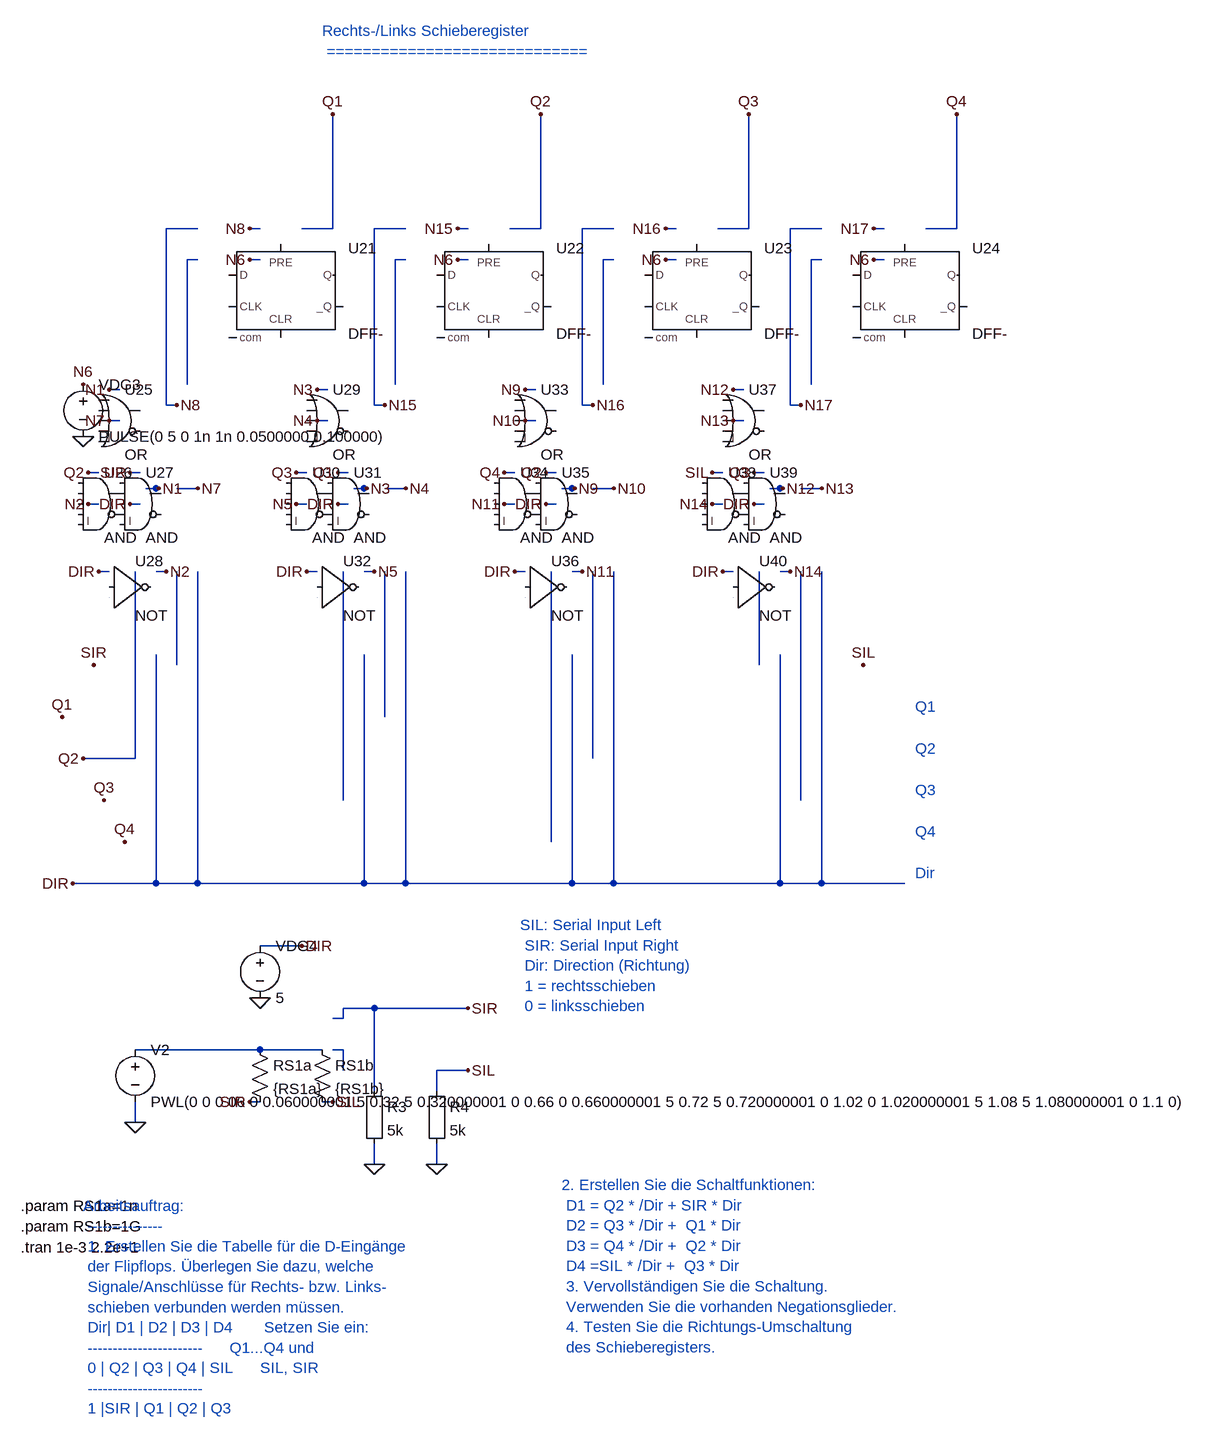
[diagram p0: schematic 6_3_2_Rechts_Links_Schieberegister_Lsg.asc]
6_3_2_Rechts_Links_Schieberegister_Lsg.asc, the LTspice schematic file:
Version 4
SHEET 1 880 680
WIRE 240 1664 240 1680
WIRE 432 1584 528 1584
WIRE 496 320 544 320
WIRE 544 320 544 144
WIRE 1136 320 1184 320
WIRE 1184 320 1184 144
WIRE 816 320 864 320
WIRE 864 320 864 144
WIRE 1504 144 1504 320
WIRE 1504 320 1456 320
WIRE 320 560 320 368
WIRE 320 368 336 368
WIRE 656 368 640 368
WIRE 640 368 640 560
WIRE 1296 368 1280 368
WIRE 1280 368 1280 560
WIRE 976 368 960 368
WIRE 960 368 960 560
WIRE 240 1696 240 1680
WIRE 256 720 272 720
WIRE 304 720 320 720
WIRE 288 592 288 320
WIRE 288 320 336 320
WIRE 576 720 592 720
WIRE 624 720 640 720
WIRE 896 720 912 720
WIRE 944 720 960 720
WIRE 1216 720 1232 720
WIRE 1264 720 1280 720
WIRE 608 592 608 320
WIRE 608 320 656 320
WIRE 928 592 928 320
WIRE 928 320 976 320
WIRE 1248 592 1248 320
WIRE 1248 320 1296 320
WIRE 144 1328 272 1328
WIRE 1232 1328 1296 1328
WIRE 1232 976 1232 1328
WIRE 976 1328 1232 1328
WIRE 976 848 976 1328
WIRE 912 1328 976 1328
WIRE 912 976 912 1328
WIRE 656 1328 912 1328
WIRE 656 848 656 1328
WIRE 592 1328 656 1328
WIRE 592 976 592 1328
WIRE 336 1328 592 1328
WIRE 336 848 336 1328
WIRE 272 1328 336 1328
WIRE 272 976 272 1328
WIRE 304 992 304 848
WIRE 160 1136 240 1136
WIRE 560 1200 560 848
WIRE 1200 992 1200 848
WIRE 1264 848 1264 1200
WIRE 880 1264 880 848
WIRE 624 1072 624 848
WIRE 1296 1328 1296 848
WIRE 1424 1328 1296 1328
WIRE 432 1424 496 1424
WIRE 432 1584 240 1584
WIRE 752 1520 608 1520
WIRE 752 1616 704 1616
WIRE 240 1136 240 848
WIRE 944 848 944 1136
WIRE 608 1760 608 1728
WIRE 608 1520 560 1520
WIRE 560 1520 560 1536
WIRE 560 1536 544 1536
WIRE 608 1648 608 1520
WIRE 704 1760 704 1728
WIRE 560 1616 560 1584
WIRE 560 1584 544 1584
WIRE 704 1648 704 1616
WIRE 1392 368 1376 368
WIRE 752 368 736 368
WIRE 432 368 416 368
WIRE 1072 368 1056 368
WIRE 256 720 276 720
WIRE 216 568 200 568
WIRE 216 616 200 616
WIRE 320 720 336 720
WIRE 288 592 304 592
WIRE 432 320 416 320
WIRE 568 696 552 696
WIRE 184 696 168 696
WIRE 888 696 872 696
WIRE 504 696 488 696
WIRE 1208 696 1192 696
WIRE 824 696 808 696
WIRE 1144 696 1128 696
WIRE 528 1664 544 1664
WIRE 248 696 232 696
WIRE 432 1664 416 1664
WIRE 1208 744 1192 744
WIRE 1160 848 1144 848
WIRE 888 744 872 744
WIRE 840 848 824 848
WIRE 568 744 552 744
WIRE 520 848 504 848
WIRE 248 744 232 744
WIRE 200 848 184 848
WIRE 184 744 168 744
WIRE 272 848 288 848
WIRE 576 720 596 720
WIRE 536 568 520 568
WIRE 536 616 520 616
WIRE 640 720 656 720
WIRE 504 744 488 744
WIRE 592 848 608 848
WIRE 896 720 916 720
WIRE 856 568 840 568
WIRE 856 616 840 616
WIRE 960 720 976 720
WIRE 824 744 808 744
WIRE 912 848 928 848
WIRE 1216 720 1236 720
WIRE 1176 568 1160 568
WIRE 1176 616 1160 616
WIRE 1280 720 1296 720
WIRE 1144 744 1128 744
WIRE 1232 848 1248 848
WIRE 608 592 624 592
WIRE 752 320 736 320
WIRE 928 592 944 592
WIRE 1072 320 1056 320
WIRE 1248 592 1264 592
WIRE 1392 320 1376 320
FLAG 160 640 0
FLAG 432 1504 0
FLAG 240 1696 0
FLAG 608 1760 0
FLAG 704 1760 0
FLAG 1376 368 N6
FLAG 736 368 N6
FLAG 416 368 N6
FLAG 160 560 N6
FLAG 1056 368 N6
FLAG 240 1696 0
FLAG 608 1760 0
FLAG 704 1760 0
FLAG 276 720 N1
FLAG 200 568 N1
FLAG 200 616 N7
FLAG 336 720 N7
FLAG 304 592 N8
FLAG 416 320 N8
FLAG 552 696 Q1
FLAG 128 1072 Q1
FLAG 544 144 Q1
FLAG 168 696 Q2
FLAG 160 1136 Q2
FLAG 864 144 Q2
FLAG 872 696 Q2
FLAG 192 1200 Q3
FLAG 1184 144 Q3
FLAG 488 696 Q3
FLAG 1192 696 Q3
FLAG 808 696 Q4
FLAG 224 1264 Q4
FLAG 1504 144 Q4
FLAG 752 1616 SIL
FLAG 1360 992 SIL
FLAG 1128 696 SIL
FLAG 544 1664 SIL
FLAG 752 1520 SIR
FLAG 176 992 SIR
FLAG 232 696 SIR
FLAG 416 1664 SIR
FLAG 1192 744 DIR
FLAG 1144 848 DIR
FLAG 872 744 DIR
FLAG 824 848 DIR
FLAG 552 744 DIR
FLAG 504 848 DIR
FLAG 232 744 DIR
FLAG 144 1328 DIR
FLAG 184 848 DIR
FLAG 496 1424 DIR
FLAG 168 744 N2
FLAG 288 848 N2
FLAG 596 720 N3
FLAG 520 568 N3
FLAG 520 616 N4
FLAG 656 720 N4
FLAG 488 744 N5
FLAG 608 848 N5
FLAG 916 720 N9
FLAG 840 568 N9
FLAG 840 616 N10
FLAG 976 720 N10
FLAG 808 744 N11
FLAG 928 848 N11
FLAG 1236 720 N12
FLAG 1160 568 N12
FLAG 1160 616 N13
FLAG 1296 720 N13
FLAG 1128 744 N14
FLAG 1248 848 N14
FLAG 624 592 N15
FLAG 736 320 N15
FLAG 944 592 N16
FLAG 1056 320 N16
FLAG 1264 592 N17
FLAG 1376 320 N17
SYMBOL Digital\dflop 464 344 R0
SYMATTR InstName U21
SYMATTR Value DFF-
SYMATTR LibreSpice kind=dff;edge=falling;async=high;vth=2.5;vhigh=5;pins=D,CLK,SET,RESET,Q,~Q
SYMBOL Digital\dflop 784 344 R0
SYMATTR InstName U22
SYMATTR Value DFF-
SYMATTR LibreSpice kind=dff;edge=falling;async=high;vth=2.5;vhigh=5;pins=D,CLK,SET,RESET,Q,~Q
SYMBOL Digital\dflop 1104 344 R0
SYMATTR InstName U23
SYMATTR Value DFF-
SYMATTR LibreSpice kind=dff;edge=falling;async=high;vth=2.5;vhigh=5;pins=D,CLK,SET,RESET,Q,~Q
SYMBOL Digital\dflop 1424 344 R0
SYMATTR InstName U24
SYMATTR Value DFF-
SYMATTR LibreSpice kind=dff;edge=falling;async=high;vth=2.5;vhigh=5;pins=D,CLK,SET,RESET,Q,~Q
SYMBOL voltage 160 544 R0
SYMATTR InstName VDG3
SYMATTR Value PULSE(0 5 0 1n 1n 0.0500000 0.100000)
SYMBOL voltage 240 1568 R0
SYMATTR InstName V2
SYMATTR Value PWL(0 0 0.06 0 0.060000001 5 0.32 5 0.320000001 0 0.66 0 0.660000001 5 0.72 5 0.720000001 0 1.02 0 1.020000001 5 1.08 5 1.080000001 0 1.1 0)
SYMBOL Digital\or 216 552 R0
SYMATTR InstName U25
SYMATTR Value OR
SYMATTR LibreSpice gate=or;inputs=2;vth=2.5;vhigh=5;pins=In1,In2,Out
SYMBOL Digital\and 184 680 R0
SYMATTR InstName U26
SYMATTR Value AND
SYMATTR LibreSpice gate=and;inputs=2;vth=2.5;vhigh=5;pins=In1,In2,Out
SYMBOL Digital\and 248 680 R0
SYMATTR InstName U27
SYMATTR Value AND
SYMATTR LibreSpice gate=and;inputs=2;vth=2.5;vhigh=5;pins=In1,In2,Out
SYMBOL Digital\inv 200 808 R0
SYMATTR InstName U28
SYMATTR Value NOT
SYMATTR LibreSpice gate=not;inputs=1;vth=2.5;vhigh=5;pins=In1,Out
SYMBOL Digital\or 536 552 R0
SYMATTR InstName U29
SYMATTR Value OR
SYMATTR LibreSpice gate=or;inputs=2;vth=2.5;vhigh=5;pins=In1,In2,Out
SYMBOL Digital\and 504 680 R0
SYMATTR InstName U30
SYMATTR Value AND
SYMATTR LibreSpice gate=and;inputs=2;vth=2.5;vhigh=5;pins=In1,In2,Out
SYMBOL Digital\and 568 680 R0
SYMATTR InstName U31
SYMATTR Value AND
SYMATTR LibreSpice gate=and;inputs=2;vth=2.5;vhigh=5;pins=In1,In2,Out
SYMBOL Digital\inv 520 808 R0
SYMATTR InstName U32
SYMATTR Value NOT
SYMATTR LibreSpice gate=not;inputs=1;vth=2.5;vhigh=5;pins=In1,Out
SYMBOL Digital\or 856 552 R0
SYMATTR InstName U33
SYMATTR Value OR
SYMATTR LibreSpice gate=or;inputs=2;vth=2.5;vhigh=5;pins=In1,In2,Out
SYMBOL Digital\and 824 680 R0
SYMATTR InstName U34
SYMATTR Value AND
SYMATTR LibreSpice gate=and;inputs=2;vth=2.5;vhigh=5;pins=In1,In2,Out
SYMBOL Digital\and 888 680 R0
SYMATTR InstName U35
SYMATTR Value AND
SYMATTR LibreSpice gate=and;inputs=2;vth=2.5;vhigh=5;pins=In1,In2,Out
SYMBOL Digital\inv 840 808 R0
SYMATTR InstName U36
SYMATTR Value NOT
SYMATTR LibreSpice gate=not;inputs=1;vth=2.5;vhigh=5;pins=In1,Out
SYMBOL Digital\or 1176 552 R0
SYMATTR InstName U37
SYMATTR Value OR
SYMATTR LibreSpice gate=or;inputs=2;vth=2.5;vhigh=5;pins=In1,In2,Out
SYMBOL Digital\and 1144 680 R0
SYMATTR InstName U38
SYMATTR Value AND
SYMATTR LibreSpice gate=and;inputs=2;vth=2.5;vhigh=5;pins=In1,In2,Out
SYMBOL Digital\and 1208 680 R0
SYMATTR InstName U39
SYMATTR Value AND
SYMATTR LibreSpice gate=and;inputs=2;vth=2.5;vhigh=5;pins=In1,In2,Out
SYMBOL Digital\inv 1160 808 R0
SYMATTR InstName U40
SYMATTR Value NOT
SYMATTR LibreSpice gate=not;inputs=1;vth=2.5;vhigh=5;pins=In1,Out
SYMBOL voltage 432 1408 R0
SYMATTR InstName VDG4
SYMATTR Value 5
SYMBOL res 416 1568 R0
SYMATTR InstName RS1a
SYMATTR Value {RS1a}
SYMBOL res 512 1568 R0
SYMATTR InstName RS1b
SYMATTR Value {RS1b}
SYMBOL Misc\EuropeanResistor 592 1632 R0
SYMATTR InstName R3
SYMATTR Value 5k
SYMBOL Misc\EuropeanResistor 688 1632 R0
SYMATTR InstName R4
SYMATTR Value 5k
TEXT 64 1824 Left 2 !.param RS1a=1n
TEXT 64 1856 Left 2 !.param RS1b=1G
TEXT 64 1888 Left 2 !.tran 1e-3 2.2e+1
TEXT 528 16 Left 2 ;Rechts-/Links Schieberegister \n =============================
TEXT 160 1824 Left 2 ;Arbeitsauftrag: \n --------------- \n 1. Erstellen Sie die Tabelle für die D-Eingänge \n der Flipflops. Überlegen Sie dazu, welche \n Signale/Anschlüsse für Rechts- bzw. Links- \n schieben verbunden werden müssen. \n Dir| D1 | D2 | D3 | D4       Setzen Sie ein: \n -----------------------      Q1...Q4 und \n 0 | Q2 | Q3 | Q4 | SIL      SIL, SIR \n ----------------------- \n 1 |SIR | Q1 | Q2 | Q3
TEXT 832 1392 Left 2 ;SIL: Serial Input Left \n SIR: Serial Input Right \n Dir: Direction (Richtung) \n 1 = rechtsschieben \n 0 = linksschieben
TEXT 896 1792 Left 2 ;2. Erstellen Sie die Schaltfunktionen: \n D1 = Q2 * /Dir + SIR * Dir \n D2 = Q3 * /Dir +  Q1 * Dir \n D3 = Q4 * /Dir +  Q2 * Dir \n D4 =SIL * /Dir +  Q3 * Dir \n 3. Vervollständigen Sie die Schaltung. \n Verwenden Sie die vorhanden Negationsglieder. \n 4. Testen Sie die Richtungs-Umschaltung \n des Schieberegisters.
TEXT 1440 1056 Left 2 ;Q1
TEXT 1440 1120 Left 2 ;Q2
TEXT 1440 1184 Left 2 ;Q3
TEXT 1440 1248 Left 2 ;Q4
TEXT 1440 1312 Left 2 ;Dir

The netlist it stands for:
* 6_3_2_Rechts_Links_Schieberegister_Lsg.asc
A§U21 0 0 0 0 0 0 0 0 DFLOP DFF-
A§U22 0 0 0 0 0 0 0 0 DFLOP DFF-
A§U23 0 0 0 0 0 0 0 0 DFLOP DFF-
A§U24 0 0 0 0 0 0 0 0 DFLOP DFF-
VDG3 N6 0 PULSE(0 5 0 1n 1n 0.0500000 0.100000)
V2 N001 0 PWL(0 0 0.06 0 0.060000001 5 0.32 5 0.320000001 0 0.66 0 0.660000001 5 0.72 5 0.720000001 0 1.02 0 1.020000001 5 1.08 5 1.080000001 0 1.1 0)
A§U25 0 0 0 0 0 0 0 0 OR OR
A§U26 0 0 0 0 0 P001 P002 0 AND AND
A§U27 0 P002 0 P001 0 0 0 0 AND AND
A§U28 0 0 0 0 0 0 0 0 BUF NOT
A§U29 0 0 0 0 0 0 0 0 OR OR
A§U30 0 0 0 0 0 P003 P004 0 AND AND
A§U31 0 P004 0 P003 0 0 0 0 AND AND
A§U32 0 0 0 0 0 0 0 0 BUF NOT
A§U33 0 0 0 0 0 0 0 0 OR OR
A§U34 0 0 0 0 0 P005 P006 0 AND AND
A§U35 0 P006 0 P005 0 0 0 0 AND AND
A§U36 0 0 0 0 0 0 0 0 BUF NOT
A§U37 0 0 0 0 0 0 0 0 OR OR
A§U38 0 0 0 0 0 P007 P008 0 AND AND
A§U39 0 P008 0 P007 0 0 0 0 AND AND
A§U40 0 0 0 0 0 0 0 0 BUF NOT
VDG4 DIR 0 5
RS1a N001 SIR {RS1a}
RS1b N001 SIL {RS1b}
R3 SIR 0 5k
R4 SIL 0 5k
.param RS1a=1n
.param RS1b=1G
.tran 1e-3 2.2e+1
* Rechts-/Links Schieberegister
*  =============================
* Arbeitsauftrag:
*  ---------------
*  1. Erstellen Sie die Tabelle für die D-Eingänge
*  der Flipflops. Überlegen Sie dazu, welche
*  Signale/Anschlüsse für Rechts- bzw. Links-
*  schieben verbunden werden müssen.
*  Dir| D1 | D2 | D3 | D4       Setzen Sie ein:
*  -----------------------      Q1...Q4 und
*  0 | Q2 | Q3 | Q4 | SIL      SIL, SIR
*  -----------------------
*  1 |SIR | Q1 | Q2 | Q3
* SIL: Serial Input Left
*  SIR: Serial Input Right
*  Dir: Direction (Richtung)
*  1 = rechtsschieben
*  0 = linksschieben
* 2. Erstellen Sie die Schaltfunktionen:
*  D1 = Q2 * /Dir + SIR * Dir
*  D2 = Q3 * /Dir +  Q1 * Dir
*  D3 = Q4 * /Dir +  Q2 * Dir
*  D4 =SIL * /Dir +  Q3 * Dir
*  3. Vervollständigen Sie die Schaltung.
*  Verwenden Sie die vorhanden Negationsglieder.
*  4. Testen Sie die Richtungs-Umschaltung
*  des Schieberegisters.
* Q1
* Q2
* Q3
* Q4
* Dir
.backanno
.end